# EAGLE schematic ScopeX (EAGLE 9.4.2)
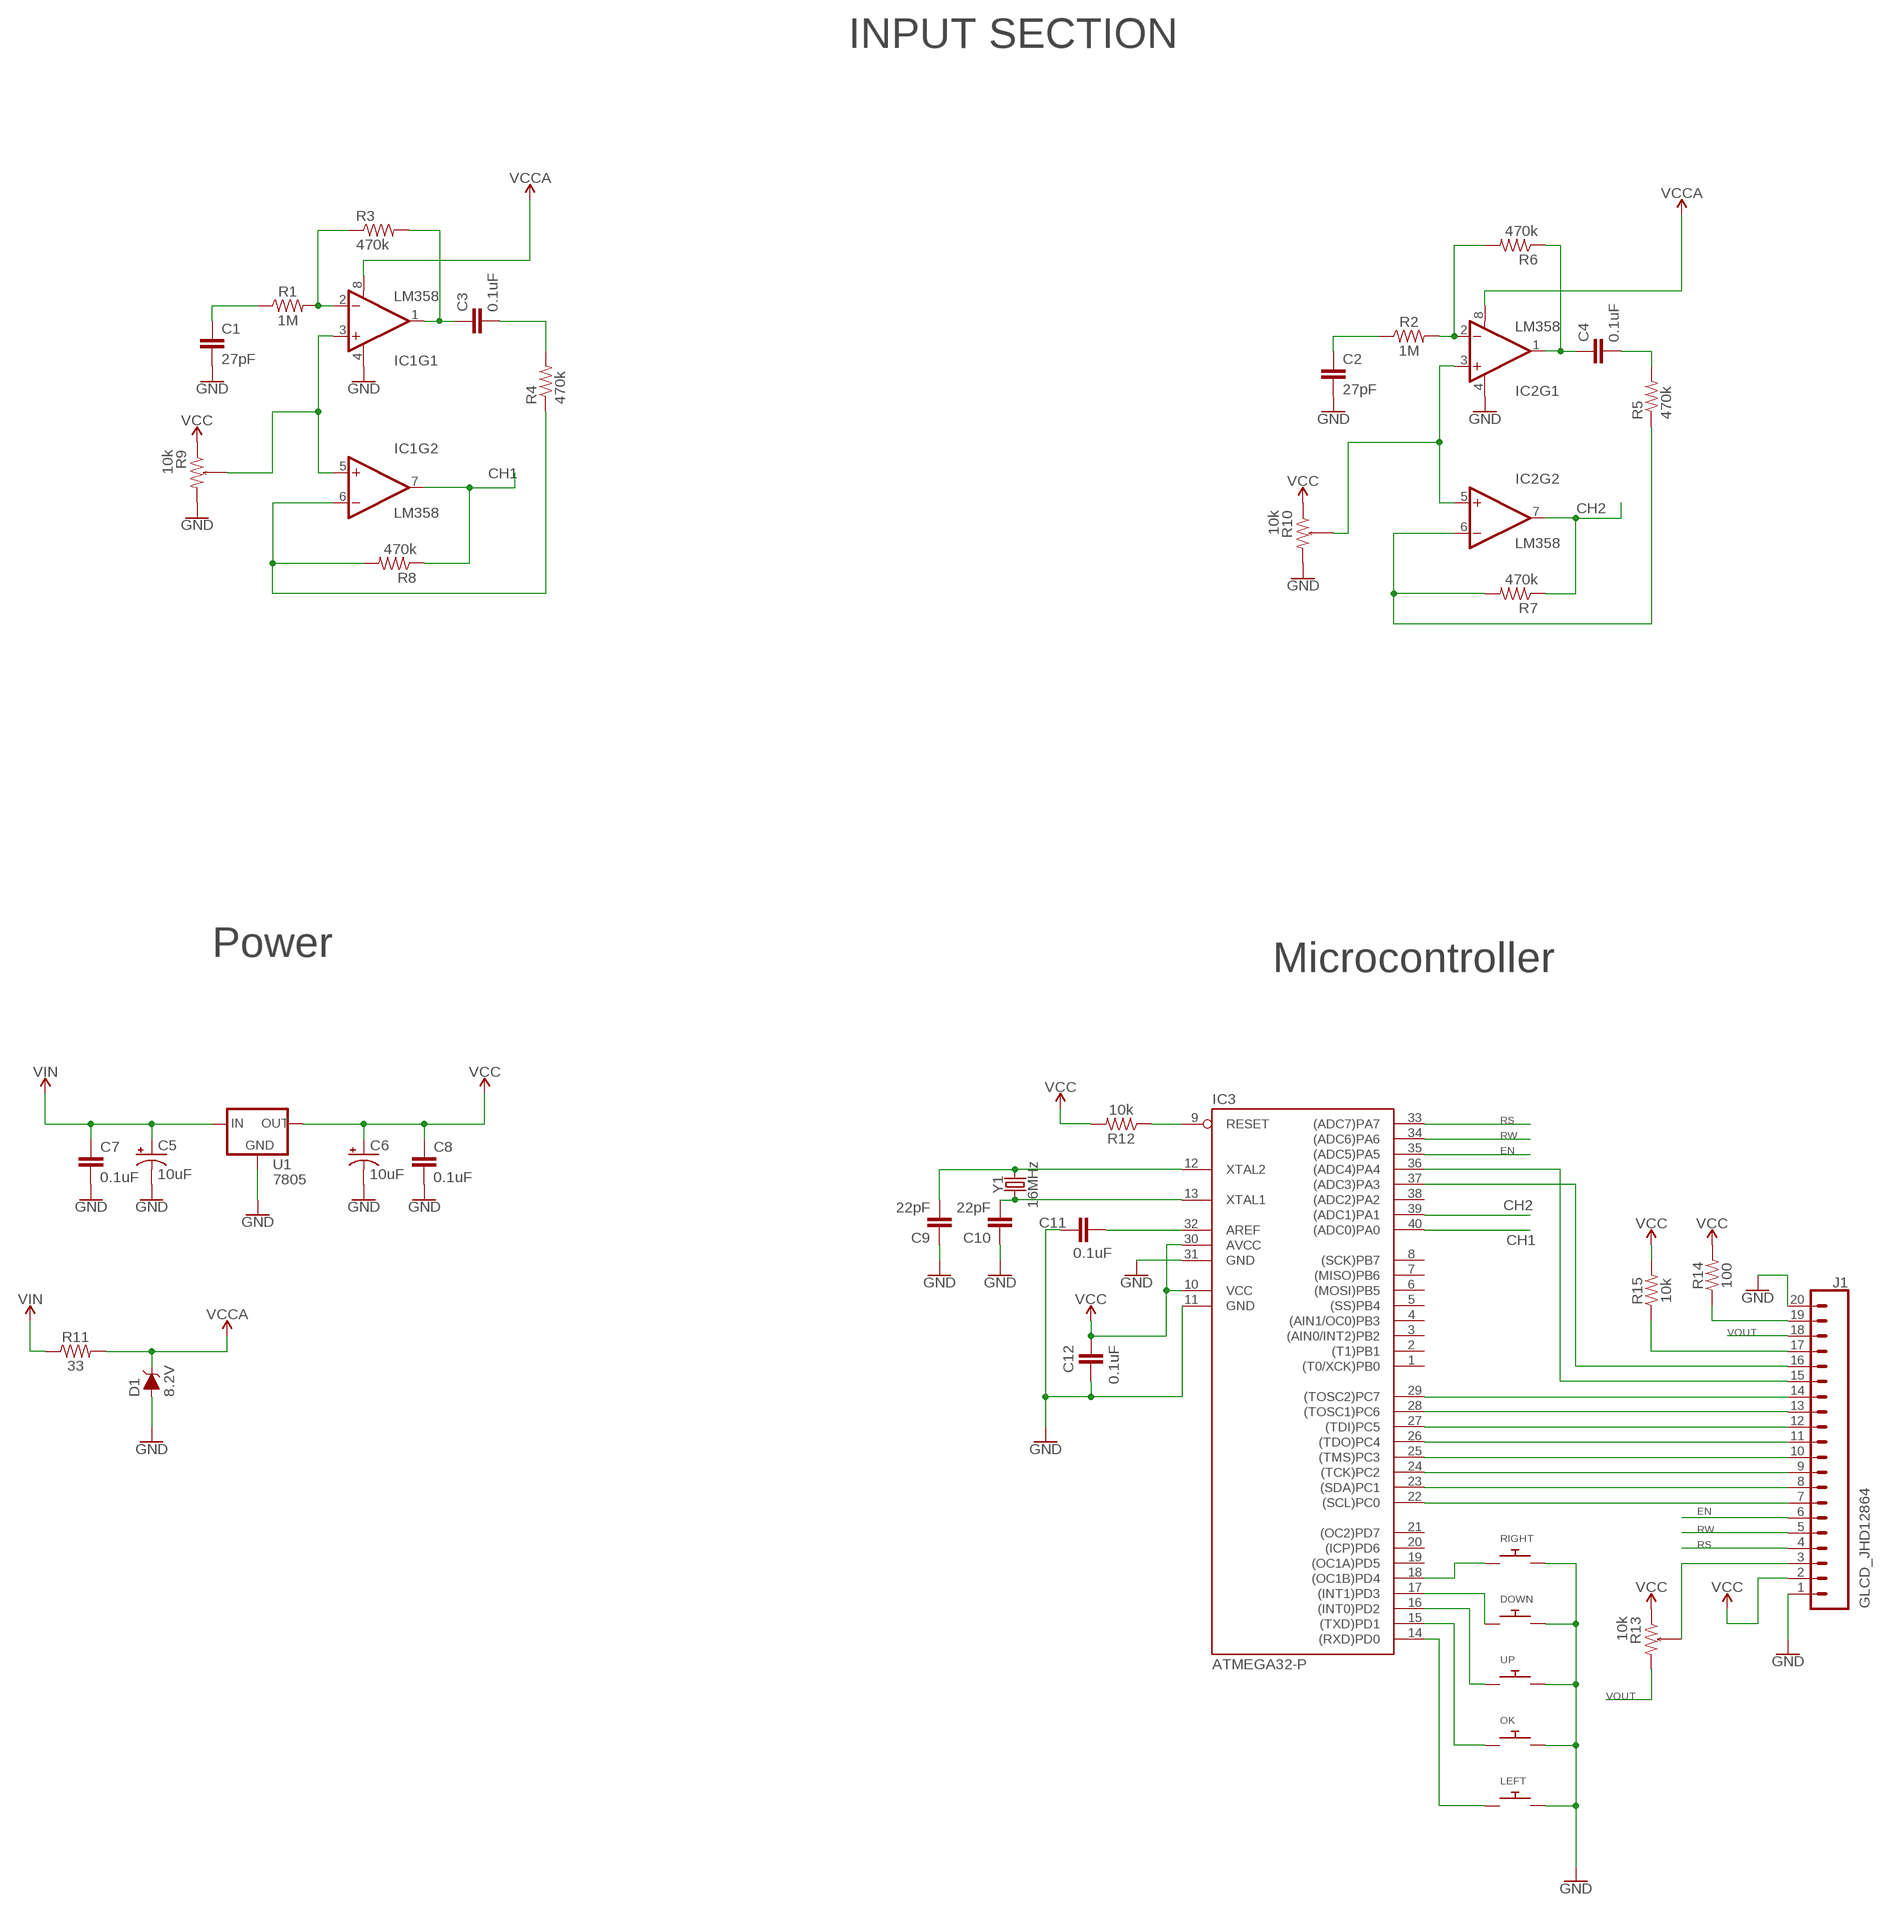
[diagram p0: schematic, sheet 1]

## Parts
C1  27pF  27PF-0603-50V-5%  [0603]
C2  27pF  27PF-0603-50V-5%  [0603]
C3  0.1uF  0.1UF-0603-25V-(+80/-20%)  [0603]
C4  0.1uF  0.1UF-0603-25V-(+80/-20%)  [0603]
C5  10uF  CAP_POLPTH2  [CPOL-RADIAL-10UF-25V]
C6  10uF  CAP_POLPTH2  [CPOL-RADIAL-10UF-25V]
C7  0.1uF  CAP1206  [1206]
C8  0.1uF  CAP1206  [1206]
C9  22pF  22PF-0603-50V-5%  [0603]
C10  22pF  22PF-0603-50V-5%  [0603]
C11  0.1uF  0.1UF-0603-25V-(+80/-20%)  [0603]
C12  0.1uF  0.1UF-0603-25V-(+80/-20%)  [0603]
D1  8.2V  DIODE-ZENER-MMSZ5232BS  [SOD-323]
DOWN  SWITCH_PUSHBUTTONSOFTTOUCHSMD_SJ  [PUSHBUTTON_SMD_SJ]
IC1  LM358  [DIP08]
IC2  LM358  [DIP08]
IC3  ATMEGA32-P  MEGA32-P  [DIL40]
J1  GLCD_JHD12864  CONN_20  [1X20]
LEFT  SWITCH_PUSHBUTTONSOFTTOUCHSMD_SJ  [PUSHBUTTON_SMD_SJ]
OK  SWITCH_PUSHBUTTONSOFTTOUCHSMD_SJ  [PUSHBUTTON_SMD_SJ]
R1  1M  1MOHM-0603-1/4W-5%  [0603]
R2  1M  1MOHM-0603-1/4W-5%  [0603]
R3  470k  RESISTOR0603-RES  [0603-RES]
R4  470k  RESISTOR0603-RES  [0603-RES]
R5  470k  RESISTOR0603-RES  [0603-RES]
R6  470k  RESISTOR0603-RES  [0603-RES]
R7  470k  RESISTOR0603-RES  [0603-RES]
R8  470k  RESISTOR0603-RES  [0603-RES]
R9  10k  POTENTIOMETER  [0603-ARV]
R10  10k  POTENTIOMETER  [0603-ARV]
R11  33  33OHM-0603-1/10W-1%  [0603]
R12  10k  10KOHM-0603-1/10W-1%  [0603]
R13  10k  POTENTIOMETER  [0603-ARV]
R14  100  100OHM-0603-1/4W-5%  [0603]
R15  10k  10KOHM-0603-1/10W-1%  [0603]
RIGHT  SWITCH_PUSHBUTTONSOFTTOUCHSMD_SJ  [PUSHBUTTON_SMD_SJ]
U1  7805  V_REG_78XX-TO-220  [TO-220-ALT]
UP  SWITCH_PUSHBUTTONSOFTTOUCHSMD_SJ  [PUSHBUTTON_SMD_SJ]
Y1  16MHz  CRYSTAL-16MHZPTH-HC49US  [HC49US]

## Nets
CH1: IC1.7(OUT) IC3.40((ADC0)PA0) R8.1
CH2: IC2.7(OUT) IC3.39((ADC1)PA1) R7.1
EN: IC3.35((ADC5)PA5) J1.6
GND: C1.2 C2.2 C5.2(-) C6.2(-) C7.2 C8.2 C9.1 C10.1 C11.1 C12.1 D1.A DOWN.P$2 IC1.4(V-) IC2.4(V-) IC3.11(GND) IC3.31(GND) J1.1 J1.20 LEFT.P$2 OK.P$2 R9.2 R10.2 RIGHT.P$2 U1.GND UP.P$2
N$1: C1.1 R1.1
N$2: IC1.2(-IN) R1.2 R3.1
N$3: C3.1 IC1.1(OUT) R3.2
N$4: C3.2 R4.2
N$5: IC2.2(-IN) R2.2 R6.2
N$6: IC1.6(-IN) R4.1 R8.2
N$7: IC3.22((SCL)PC0) J1.7
N$8: C2.1 R2.1
N$9: C4.1 IC2.1(OUT) R6.1
N$10: C4.2 R5.2
N$11: IC1.3(+IN) IC1.5(+IN) R9.3 R9.4 R9.5 R9.6 R9.7 R9.8
N$12: IC3.23((SDA)PC1) J1.8
N$13: IC2.3(+IN) IC2.5(+IN) R10.3 R10.4 R10.5 R10.6 R10.7 R10.8
N$14: IC2.6(-IN) R5.1 R7.2
N$15: C10.2 IC3.13(XTAL1) Y1.1
N$16: C9.2 IC3.12(XTAL2) Y1.2
N$17: C11.2 IC3.32(AREF)
N$18: IC3.9(RESET) R12.1
N$19: IC3.24((TCK)PC2) J1.9
N$20: IC3.25((TMS)PC3) J1.10
N$21: IC3.26((TDO)PC4) J1.11
N$22: IC3.27((TDI)PC5) J1.12
N$23: IC3.28((TOSC1)PC6) J1.13
N$24: IC3.29((TOSC2)PC7) J1.14
N$25: J1.3 R13.3 R13.4 R13.5 R13.6 R13.7 R13.8
N$26: J1.17 R15.1
N$27: J1.19 R14.1
N$28: IC3.36((ADC4)PA4) J1.15
N$29: IC3.37((ADC3)PA3) J1.16
N$30: IC3.18((OC1B)PD4) RIGHT.P$1
N$31: DOWN.P$1 IC3.17((INT1)PD3)
N$32: IC3.16((INT0)PD2) UP.P$1
N$33: IC3.15((TXD)PD1) OK.P$1
N$34: IC3.14((RXD)PD0) LEFT.P$1
RS: IC3.33((ADC7)PA7) J1.4
RW: IC3.34((ADC6)PA6) J1.5
VCC: C6.1(+) C8.1 C12.2 IC3.10(VCC) IC3.30(AVCC) J1.2 R9.1 R10.1 R12.2 R13.1 R14.2 R15.2 U1.OUT
VCCA: D1.C IC1.8(V+) IC2.8(V+) R11.2
VIN: C5.1(+) C7.1 R11.1 U1.IN
VOUT: J1.18 R13.2
Unconnected: IC3.1((T0/XCK)PB0) IC3.2((T1)PB1) IC3.3((AIN0/INT2)PB2) IC3.4((AIN1/OC0)PB3) IC3.5((SS)PB4) IC3.6((MOSI)PB5) IC3.7((MISO)PB6) IC3.8((SCK)PB7) IC3.19((OC1A)PD5) IC3.20((ICP)PD6) IC3.21((OC2)PD7) IC3.38((ADC2)PA2)

## Notes on the sheet
- INPUT SECTION
- Power
- Microcontroller

## Library data of the parts
C1 C2 = SparkFun-Capacitors:27PF: 27pF ceramic capacitors A capacitor is a passive two-terminal electrical component used to store electrical energy temporarily in an electric field.; PROD_ID: CAP-09989
C3 C4 C11 C12 = SparkFun-Capacitors:0.1UF: 0.1µF ceramic capacitors A capacitor is a passive two-terminal electrical component used to store electrical energy temporarily in an electric field.; PROD_ID: CAP-00810
C5 C6 = SparkFun-Passives:CAP_POL: Capacitor Polarized These are standard SMD and PTH capacitors. Normally 10uF, 47uF, and 100uF in electrolytic and tantalum varieties. Always verify the external diameter of the through hole cap, it varies with capacity, voltage, and manufacturer. The EIA devices should be standard.
C7 C8 = SparkFun-Passives:CAP: Capacitor Standard 0603 ceramic capacitor, and 0.1" leaded capacitor.
C9 C10 = SparkFun-Capacitors:22PF: 22pF ceramic capacitors A capacitor is a passive two-terminal electrical component used to store electrical energy temporarily in an electric field.; PROD_ID: CAP-07876
D1 = SparkFun-DiscreteSemi:DIODE-ZENER: Zener Diode A Zener diode allows current to flow from its anode to its cathode like a normal semiconductor diode, but it also permits current to flow in the reverse direction when its "Zener voltage" is reached. - WIkipedia; PROD_ID: DIO-12442; VALUE: 5.6V
DOWN LEFT OK RIGHT UP = adafruit:SWITCH_PUSHBUTTON: Buttons SOFTTOUCHSMD_SJ - Soft touch temporary push button (Super Junk Akihabara) Compatible with SKPMANE010 [Mouser: 688-SKPMAN] C&K_KSS = Digikey: KSS221GLFS
IC1 IC2 = SparkFun-AnalogIC:LM358: Jellybean op-amp; PROD_ID: IC-09172
IC3 = atmel:MEGA32-P: MICROCONTROLLER 32 Kbytes FLASH 2 Kbytes SRAM 1 Kbytes EEPROM USART 8-channel 10 bit ADC Source: www.atmel.com .. doc2503.pdf; MPN: ATMEGA32-16PU; OC_FARNELL: 1661729; OC_NEWARK: 51P1794
J1 = SparkFun-Connectors:CONN_20: Multi connection point. Often used as Generic Header-pin footprint for 0.1 inch spaced/style header connections On any of the 0.1 inch spaced packages, you can populate with these: Break Away Headers - Straight <https://www.sparkfun.com/products/116> (PRT-00116) Break Away Male Headers - Right Angle <https://www.sparkfun.com/products/553> (PRT-00553) Female Headers <https://www.sparkfun.com/products/115> (PRT-00115) Break Away Headers - Machine Pin <https://www.sparkfun.com/products/117> (PRT-00117) Break Away Female Headers - Swiss Machine Pin <https://www.sparkfun.com/products/743> (PRT-00743) For SCREWTERMINALS and SPRING TERMINALS visit here: Screw Terimnals on SparkFun.com <https://www.sparkfun.com/search/results?term=Screw+Terminals> (5mm/3.5mm/2.54mm spacing) This device is also useful as a general connection point to wire up your design to another part of your project. Our various solder wires solder well into these plated through hole pads. Hook-Up Wire - Assortment (Stranded, 22 AWG) <https://www.sparkfun.com/products/11375> (PRT-11375) Hook-Up Wire - Assortment (Solid Core, 22 AWG) <https://www.sparkfun.com/products/11367> (PRT-11367) View the entire wire category on our website here <https://www.sparkfun.com/categories/141> Special notes: Molex polarized connector foot print use with SKU : PRT-08231 with associated crimp pins and housings. 1MM SMD Version SKU: PRT-10208 NOTES ON THE VARIANTS LOCK and LOCK_LONGPADS... This footprint was designed to help hold the alignment of a through-hole component (i.e. 6-pin header) while soldering it into place. You may notice that each hole has been shifted either up or down by 0.005 of an inch from it's more standard position (which is a perfectly straight line). This slight alteration caused the pins (the squares in the middle) to touch the edges of the holes. Because they are alternating, it causes a "brace" to hold the component in place. 0.005 has proven to be the perfect amount of "off-center" position when using our standard breakaway headers. Although looks a little odd when you look at the bare footprint, once you have a header in there, the alteration is very hard to notice. Also,if you push a header all the way into place, it is covered up entirely on the bottom side. Note about LOCK SPECIAL package: This is just like the LOCK variant in that the holes are staggared by 5 mil, but except for the last two holes. They are not altered from the "standard" footprint layout. This is used for a special purpose on the layout of our Graphic LCD Backpack. Make sure you want to use this device before selecting it for you project!
R1 R2 = SparkFun-Resistors:1MOHM: 1MΩ resistor A resistor is a passive two-terminal electrical component that implements electrical resistance as a circuit element. Resistors act to reduce current flow, and, at the same time, act to lower voltage levels within circuits. - Wikipedia; PROD_ID: RES-07868
R3-R8 = SparkFun-Passives:RESISTOR: Resistor Basic schematic elements and footprints for 0603, 1206, and PTH resistors.
R9 R10 R13 = SparkFun-Passives:POTENTIOMETER
R11 = SparkFun-Resistors:33OHM: 33Ω resistor A resistor is a passive two-terminal electrical component that implements electrical resistance as a circuit element. Resistors act to reduce current flow, and, at the same time, act to lower voltage levels within circuits. - Wikipedia; PROD_ID: RES-08270
R12 R15 = SparkFun-Resistors:10KOHM: 10kΩ resistor A resistor is a passive two-terminal electrical component that implements electrical resistance as a circuit element. Resistors act to reduce current flow, and, at the same time, act to lower voltage levels within circuits. - Wikipedia; PROD_ID: RES-00824
R14 = SparkFun-Resistors:100OHM: 100Ω resistor A resistor is a passive two-terminal electrical component that implements electrical resistance as a circuit element. Resistors act to reduce current flow, and, at the same time, act to lower voltage levels within circuits. - Wikipedia; PROD_ID: RES-12438
U1 = SparkFun-PowerIC:V_REG_78XX: Voltage Regulator Standard 78xx regulator. IGO (Input Ground Output). Spark Fun Electronics SKU : COM-00107; PROD_ID: VREG-08450; SF_ID: COM-00107
Y1 = SparkFun-Clocks:CRYSTAL-16MHZ: 16MHz Crystal Digikey Example <http://www.digikey.com/product-search/en?keywords=535-9122-1-ND> Frequency: 16MHz Frequency Stability: ±50ppm Frequency Tolerance: ±20ppm Load Capacitance: 18pF SparkFun Products: Pro Micro -5V/16MHz <https://www.sparkfun.com/products/12640> SparkFun Serial Enabled LCD Kit <https://www.sparkfun.com/products/10097>; PROD_ID: XTAL-08181; SF_ID: COM-00536